# Altium schematic sheet SFP.SchDoc: SPEC-A7
size 420 x 297 mm; Author: G.Kasprowicz; CompanyName: WUT ISE; DrawnBy: G.Kasprowicz; Organization: WUT ISE; Address1: PW ISE; Address2: Nowowiejska 15/19 00-665 Warsaw; Address3: gkasprow@gmail.com; Revision: 2; SheetNumber: 12; SheetTotal: 18; ModifiedBy: -; CheckedDate: -; Title2: SFPs; DivGrp: WUT ISE; Designer: G.Kasprowicz; ModifiedDate: -; ProjectName: Sensor Box
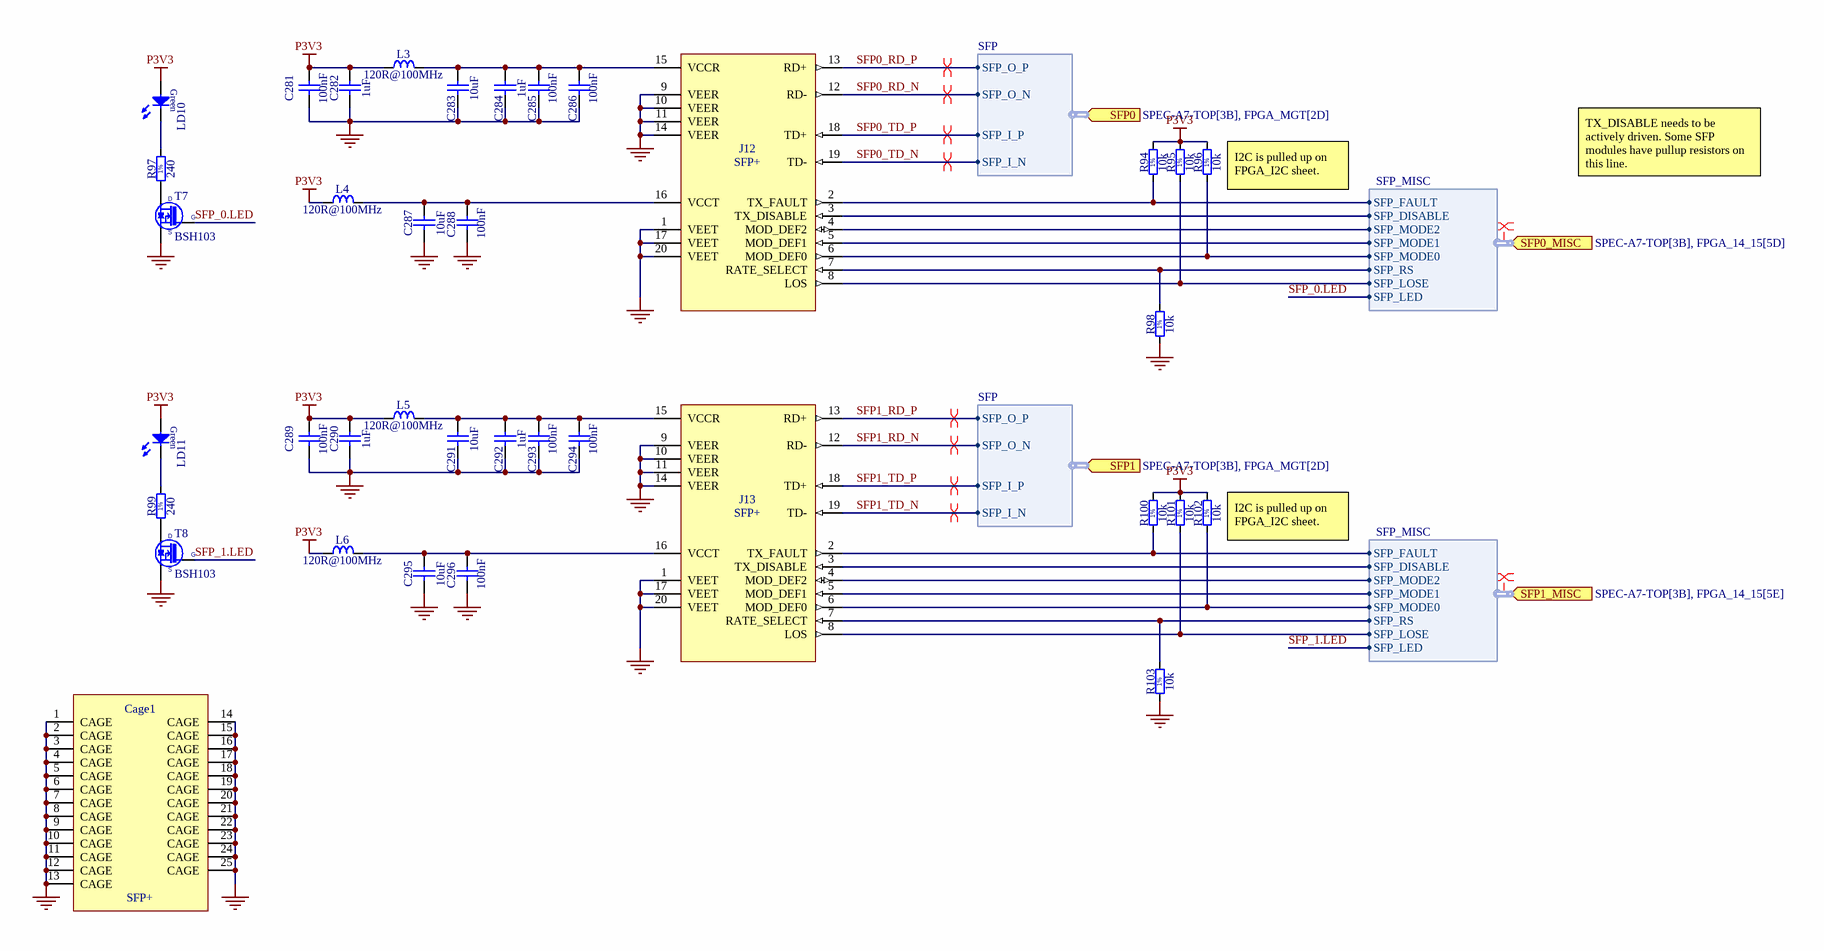
[diagram p0: SFP.SchDoc]

## Parts
C281  100nF  [CAPC0603X33N]
C282  1uF  [CAPC1005X55N]
C283  10uF  [CAPC1608X80N]
C284  1uF  [CAPC1005X55N]
C285  100nF  [CAPC0603X33N]
C286  100nF  [CAPC0603X33N]
C287  10uF  [CAPC1608X80N]
C288  100nF  [CAPC0603X33N]
C289  100nF  [CAPC0603X33N]
C290  1uF  [CAPC1005X55N]
C291  10uF  [CAPC1608X80N]
C292  1uF  [CAPC1005X55N]
C293  100nF  [CAPC0603X33N]
C294  100nF  [CAPC0603X33N]
C295  10uF  [CAPC1608X80N]
C296  100nF  [CAPC0603X33N]
Cage1  SFP+  [TYCO_2007263-1]
J12  SFP+  [MOLEX_74441-0001]
J13  SFP+  [MOLEX_74441-0001]
L3  120R@100MHz  [INDC1608X65N]
L4  120R@100MHz  [INDC1608X65N]
L5  120R@100MHz  [INDC1608X65N]
L6  120R@100MHz  [INDC1608X65N]
LD10  Green  [LED_AVAGO_HSME-C120]  (value not drawn)
LD11  Green  [LED_AVAGO_HSME-C120]  (value not drawn)
R94  10k  [RESC1005X40N]
R95  10k  [RESC1005X40N]
R96  10k  [RESC1005X40N]
R97  240  [RESC1005X40N]
R98  10k  [RESC1005X40N]
R99  240  [RESC1005X40N]
R100  10k  [RESC1005X40N]
R101  10k  [RESC1005X40N]
R102  10k  [RESC1005X40N]
R103  10k  [RESC1005X40N]
T7  BSH103  [SOT95P230X110-3N]
T8  BSH103  [SOT95P230X110-3N]

## Ports
SFP0 (in, harness SFP, see SPEC-A7-TOP[3B], FPGA_MGT[2D]), SFP0_MISC (in, harness SFP_MISC, see SPEC-A7-TOP[3B], FPGA_14_15[5D]), SFP1 (in, harness SFP, see SPEC-A7-TOP[3B], FPGA_MGT[2D]), SFP1_MISC (in, harness SFP_MISC, see SPEC-A7-TOP[3B], FPGA_14_15[5E])

## Harnesses
SFP_MISC: SFP_FAULT, SFP_DISABLE, SFP_MODE2, SFP_MODE1, SFP_MODE0, SFP_RS, SFP_LOSE, SFP_LED
SFP: SFP_O_P, SFP_O_N, SFP_I_P, SFP_I_N

## Nets
GND: C281.1 C282.1 C283.1 C284.1 C285.1 C286.1 C287.1 C288.1 C289.1 C290.1 C291.1 C292.1 C293.1 C294.1 C295.1 C296.1 Cage1.1(CAGE) Cage1.2(CAGE) Cage1.3(CAGE) Cage1.4(CAGE) Cage1.5(CAGE) Cage1.6(CAGE) Cage1.7(CAGE) Cage1.8(CAGE) Cage1.9(CAGE) Cage1.10(CAGE) Cage1.11(CAGE) Cage1.12(CAGE) Cage1.13(CAGE) Cage1.14(CAGE) Cage1.15(CAGE) Cage1.16(CAGE) Cage1.17(CAGE) Cage1.18(CAGE) Cage1.19(CAGE) Cage1.20(CAGE) Cage1.21(CAGE) Cage1.22(CAGE) Cage1.23(CAGE) Cage1.24(CAGE) Cage1.25(CAGE) J12.1(VEET) J12.9(VEER) J12.10(VEER) J12.11(VEER) J12.14(VEER) J12.17(VEET) J12.20(VEET) J13.1(VEET) J13.9(VEER) J13.10(VEER) J13.11(VEER) J13.14(VEER) J13.17(VEET) J13.20(VEET) R98.1 R103.1 T7.2(S) T8.2(S)
P3V3: C281.2 C282.2 C289.2 C290.2 L3.1 L4.1 L5.1 L6.1 LD10.2(A) LD11.2(A) R94.2 R95.2 R96.2 R100.2 R101.2 R102.2
SFP0_RD_N: J12.12(RD-) ; port SFP0.SFP_O_N
SFP0_RD_P: J12.13(RD+) ; port SFP0.SFP_O_P
SFP0_TD_N: J12.19(TD-) ; port SFP0.SFP_I_N
SFP0_TD_P: J12.18(TD+) ; port SFP0.SFP_I_P
SFP1_RD_N: J13.12(RD-) ; port SFP1.SFP_O_N
SFP1_RD_P: J13.13(RD+) ; port SFP1.SFP_O_P
SFP1_TD_N: J13.19(TD-) ; port SFP1.SFP_I_N
SFP1_TD_P: J13.18(TD+) ; port SFP1.SFP_I_P
SFP_0.LED: T7.1(G) ; port SFP0_MISC.SFP_LED
SFP_1.LED: T8.1(G) ; port SFP1_MISC.SFP_LED
NetC283_2: C283.2 C284.2 C285.2 C286.2 J12.15(VCCR) L3.2
NetC287_2: C287.2 C288.2 J12.16(VCCT) L4.2
NetC291_2: C291.2 C292.2 C293.2 C294.2 J13.15(VCCR) L5.2
NetC295_2: C295.2 C296.2 J13.16(VCCT) L6.2
NetJ12_2: J12.2(TX_FAULT) R94.1 ; port SFP0_MISC.SFP_FAULT
NetJ12_3: J12.3(TX_DISABLE) ; port SFP0_MISC.SFP_DISABLE
NetJ12_4: J12.4(MOD_DEF2) ; port SFP0_MISC.SFP_MODE2
NetJ12_5: J12.5(MOD_DEF1) ; port SFP0_MISC.SFP_MODE1
NetJ12_6: J12.6(MOD_DEF0) R96.1 ; port SFP0_MISC.SFP_MODE0
NetJ12_7: J12.7(RATE_SELECT) R98.2 ; port SFP0_MISC.SFP_RS
NetJ12_8: J12.8(LOS) R95.1 ; port SFP0_MISC.SFP_LOSE
NetJ13_2: J13.2(TX_FAULT) R100.1 ; port SFP1_MISC.SFP_FAULT
NetJ13_3: J13.3(TX_DISABLE) ; port SFP1_MISC.SFP_DISABLE
NetJ13_4: J13.4(MOD_DEF2) ; port SFP1_MISC.SFP_MODE2
NetJ13_5: J13.5(MOD_DEF1) ; port SFP1_MISC.SFP_MODE1
NetJ13_6: J13.6(MOD_DEF0) R102.1 ; port SFP1_MISC.SFP_MODE0
NetJ13_7: J13.7(RATE_SELECT) R103.2 ; port SFP1_MISC.SFP_RS
NetJ13_8: J13.8(LOS) R101.1 ; port SFP1_MISC.SFP_LOSE
NetLD10_1: LD10.1(C) R97.2
NetLD11_1: LD11.1(C) R99.2
NetR97_1: R97.1 T7.3(D)
NetR99_1: R99.1 T8.3(D)

## Layout directives
differential pair; differential pair class Diff_100Ohm: SFP0_RD_N, SFP0_RD_P, SFP0_TD_N, SFP0_TD_P, SFP1_RD_N, SFP1_RD_P, SFP1_TD_N, SFP1_TD_P
net class SFP0: (no net found under the mark)
net class SFP1: (no net found under the mark)

## Notes on the sheet
- (near R96) I2C is pulled up on FPGA_I2C sheet.
- TX_DISABLE needs to be actively driven. Some SFP modules have pullup resistors on this line.
- (near R102) I2C is pulled up on FPGA_I2C sheet.
- Project/Equipment
- Document
- Designer
- Drawn by
- Check.by
- Copyright WUT ISE 2024.
  This documentation describes Open Hardware and is licensed under the CERN OHL v.2. You may redistribute and modify this documentation under the terms of the CERN OHL v.2. (http://ohwr.org/CERNOHL). This documentation is distributed WITHOUT ANY EXPRESS OR IMPLIED WARRANTY, INCLUDING OF MERCHANTABILITY, SATISFACTORY QUALITY AND FITNESS FOR A PARTICULAR PURPOSE. Please see the CERN OHL v.2 for applicable conditions.
- Contact
- File
- Last Mod.
- Print Date
- Sheet
- Size
- A3
- of
- Rev
- (in symbol R0402_10K_1%_0.0625W_100PPM) 1%
- (in symbol R0402_240R_1%_0.0625W_100PPM) 1%

## Library data of the parts
C281 C285 C286 C288 C289 C293 C294 C296 = CC0201_100NF_6.3V_10%_X5R: Non-polarised capacitor; Part Description: SMD Multilayer Chip Ceramic Capacitor; Manufacturer: GENERIC; Manufacturer1 Part Number: 02016D104KAT2A; Voltage: 6.3V; TC: X5R; Tolerance: ±10%; Part Number: CC0201_100NF_6.3V_10%_X5R; Component Kind: Standard; Component Type: Standard; Pin Count: 2; Value: 100nF; Status: Not Recommended; Manufacturer Part Number: CC0201_100NF_6.3V_10%_X5R; Case: 0201; Mounted: Yes; Socket: No; SMD: Yes; Sense: No; Manufacturer1 Example: AVX; Manufacturer1 ComponentHeight: 0.33mm; HelpURL: \\cern.ch\dfs\Applications\Altium\Datasheets\CC0201_X5R_AVX.pdf; Author: CERN DEM JLC; CreateDate: 2007-12-03; LatestRevisionDate: 2007-12-03
C282 C284 C290 C292 = CC0402_1UF_16V_10%_X5R: Non-polarised capacitor; Part Description: SMD Multilayer Chip Ceramic Capacitor; Manufacturer: GENERIC; Manufacturer1 Part Number: C1005X5R1C105KT; Voltage: 16V; TC: X5R; Tolerance: ±10%; Part Number: CC0402_1UF_16V_10%_X5R; Component Kind: Standard; Component Type: Standard; Pin Count: 2; Value: 1uF; Status: Preferred; Manufacturer Part Number: CC0402_1UF_16V_10%_X5R; Case: 0402; Mounted: Yes; Socket: No; SMD: Yes; Sense: No; Manufacturer1 Example: TDK; Manufacturer1 ComponentHeight: 0.55mm; HelpURL: \\cern.ch\dfs\Applications\Altium\Datasheets\CC0402_X5R_TDK_C.pdf; Author: CERN DEM JLC; CreateDate: 2012-10-25; LatestRevisionDate: 2012-10-25
C283 C287 C291 C295 = CC0603_10UF_16V_20%_X5R: Non-polarised capacitor; Part Description: SMD Multilayer Chip Ceramic Capacitor; Manufacturer: GENERIC; Manufacturer1 Part Number: GRM188R61C106MA73D; Voltage: 16V; TC: X5R; Tolerance: ±20%; Part Number: CC0603_10UF_16V_20%_X5R; Component Kind: Standard; Component Type: Standard; Pin Count: 2; Value: 10uF; Status: None; Manufacturer Part Number: CC0603_10UF_16V_20%_X5R; Case: 0603; Mounted: Yes; Socket: No; SMD: Yes; Sense: No; Manufacturer1 Example: MURATA; Manufacturer1 ComponentHeight: 0.8mm; HelpURL: \\cern.ch\dfs\Applications\Altium\Datasheets\CC0603_X5R_MURATA_GRM.pdf; Author: CERN DEM MR; CreateDate: 02.03.2016; LatestRevisionDate: 02.03.2016
Cage1 = TYCO_2007263-1: SFP 1x2 Cage (25Pins); Part Description: 1x2 Press Fit SFP+ Cage with EMI Springs; Manufacturer: TYCO ELECTRONICS; Part Number: TYCO_2007263-1; Component Kind: Standard; Component Type: Standard; Pin Count: 25; Family: SFP+; Mounted: Yes; Socket: No; SMD: No; PressFit: Yes; Sense: No; Status: None; Manufacturer Part Number: 2007263-1; ComponentHeight: 9.7mm; HelpURL: \\cern.ch\dfs\Applications\Altium\Datasheets\TYCO_2007263-1.pdf; Author: CERN DEM JLC; CreateDate: 18.01.2017; LatestRevisionDate: 18.01.2017
J12 J13 = MOLEX_74441-0001: 20 Position SFP  Connector (Small Form-factor Pluggable); Part Description: 20 Position, Pitch 0.8mm SFP Receptacle (Small Form-factor Pluggable); Manufacturer: MOLEX; PressFit: No; Part Number: MOLEX_74441-0001; Component Kind: Standard; Component Type: Standard; Pin Count: 20; Family: SFP+; Mounted: Yes; Socket: No; SMD: Yes; Sense: No; Status: None; Manufacturer Part Number: 74441-0001; ComponentHeight: 5.4mm; HelpURL: \\cern.ch\dfs\Applications\Altium\Datasheets\MOLEX_74441-0001.pdf; ComponentLink1URL: \\cern.ch\dfs\Applications\Altium\Datasheets\MOLEX_SFP_Application.pdf; ComponentLink1Description: Application; Author: CERN DEM MR; CreateDate: 03.12.2015; LatestRevisionDate: 03.12.2015
L3-L6 = IND0603_MURATA_BLM18SG121TN1D: Inductor; Part Description: SMD EMIFIL Suppression Chip Ferrite Bead; Manufacturer: MURATA; Power: 3A; Resistance: 0.025R; Tolerance: ±25%; Part Number: IND0603_MURATA_BLM18SG121TN1D; Component Kind: Standard; Component Type: Standard; Pin Count: 2; Value: 120R@100MHz; Status: None; Manufacturer Part Number: BLM18SG121TN1D; Case: 0603; Mounted: Yes; Socket: No; SMD: Yes; Sense: No; ComponentHeight: 0.65mm; HelpURL: \\cern.ch\dfs\Applications\Altium\Datasheets\IND0603_MURATA_BLM18S.pdf; Author: CERN DEM JLC; CreateDate: 23.07.2014; LatestRevisionDate: 23.07.2014
LD10 LD11 = LED_AVAGO_HSME-C120: LED Green 1C 2A; Part Description: High Performance Right Angle Chip Green LED; Manufacturer: AVAGO TECHNOLOGIES; PressFit: No; Bonding: No; Part Number: LED_AVAGO_HSME-C120; Component Kind: Standard; Component Type: Standard; Color: Green; PackageDescription: Green Chip LED, 2-Leads, Body 1.7x1.1mm, Side Emitting Package; Manufacturer Part Number: HSME-C120; Pin Count: 2; Mounted: Yes; Socket: No; SMD: Yes; Sense: No; ComponentHeight: 0.7mm; HelpURL: \\cern.ch\dfs\Applications\Altium\Datasheets\LED_AVAGO_HSME-C120.pdf; ComponentLink1URL: \\cern.ch\dfs\Applications\Altium\Datasheets\LED_AVAGO_HSME-C110_DESIGN-GUIDE.pdf; ComponentLink1Description: Design Guide; Author: CERN DEM JMW; CreateDate: 22.07.2009; LatestRevisionDate: 20.06.2012
R94-R96 R98 R100-R103 = R0402_10K_1%_0.0625W_100PPM: Resistor - 1%; Part Description: General Purpose Thick Film Chip Resistor; Manufacturer: GENERIC; Manufacturer1 Part Number: 232270671003L; TC: ±100ppm/°C; PressFit: No; Part Number: R0402_10K_1%_0.0625W_100PPM; Component Kind: Standard; Component Type: Standard; Pin Count: 2; Value: 10k; Status: Not Recommended; Power: 0.0625W; Tolerance: ±1%; Manufacturer Part Number: R0402_10K_1%_0.0625W_100PPM; Case: 0402; Mounted: Yes; Sense: No; Socket: No; SMD: Yes; Manufacturer1 Example: YAGEO PHYCOMP; Manufacturer1 ComponentHeight: 0.4mm; HelpURL: \\cern.ch\dfs\Applications\Altium\Datasheets\R0402_Phycomp_RC0402.pdf; Author: CERN DEM JLC; CreateDate: 03.12.2007; LatestRevisionDate: 17.10.2012
R97 R99 = R0402_240R_1%_0.0625W_100PPM: Resistor - 1%; Part Description: General Purpose Thick Film Chip Resistor; Manufacturer: GENERIC; Manufacturer1 Part Number: 232270672401L; TC: ±100ppm/°C; PressFit: No; Part Number: R0402_240R_1%_0.0625W_100PPM; Component Kind: Standard; Component Type: Standard; Pin Count: 2; Value: 240; Status: Not Recommended; Power: 0.0625W; Tolerance: ±1%; Manufacturer Part Number: R0402_240R_1%_0.0625W_100PPM; Case: 0402; Mounted: Yes; Sense: No; Socket: No; SMD: Yes; Manufacturer1 Example: YAGEO PHYCOMP; Manufacturer1 ComponentHeight: 0.4mm; HelpURL: \\cern.ch\dfs\Applications\Altium\Datasheets\R0402_Phycomp_RC0402.pdf; Author: CERN DEM JLC; CreateDate: 03.12.2007; LatestRevisionDate: 17.10.2012
T7 T8 = BSH103: N-CHANNEL MOSFET WITH DIODE; Part Description: 30V 850mA N-Channel Enhancement Mode Field-Effect Transistor; Manufacturer: NEXPERIA; PressFit: No; Bonding: No; Part Number: BSH103; Component Kind: Standard; Component Type: Standard; Device: BSH103; PackageDescription: SOT23, 3 pin, Pitch 0.95mm - 1.3mm W X 2.9mm L X 1.1mm H, IPC Medium Density; Manufacturer Part Number: BSH103; Pin Count: 3; Case: SOT23-3; Mounted: Yes; Socket: No; SMD: Yes; Sense: No; ComponentHeight: 1.1mm; HelpURL: \\cern.ch\dfs\Applications\Altium\Datasheets\BSH103.pdf; Author: CERN DEM JLC; CreateDate: 16.03.2010; LatestRevisionDate: 20.06.2017